# EAGLE design SAMD11_Breakout (EAGLE 6.6.0)
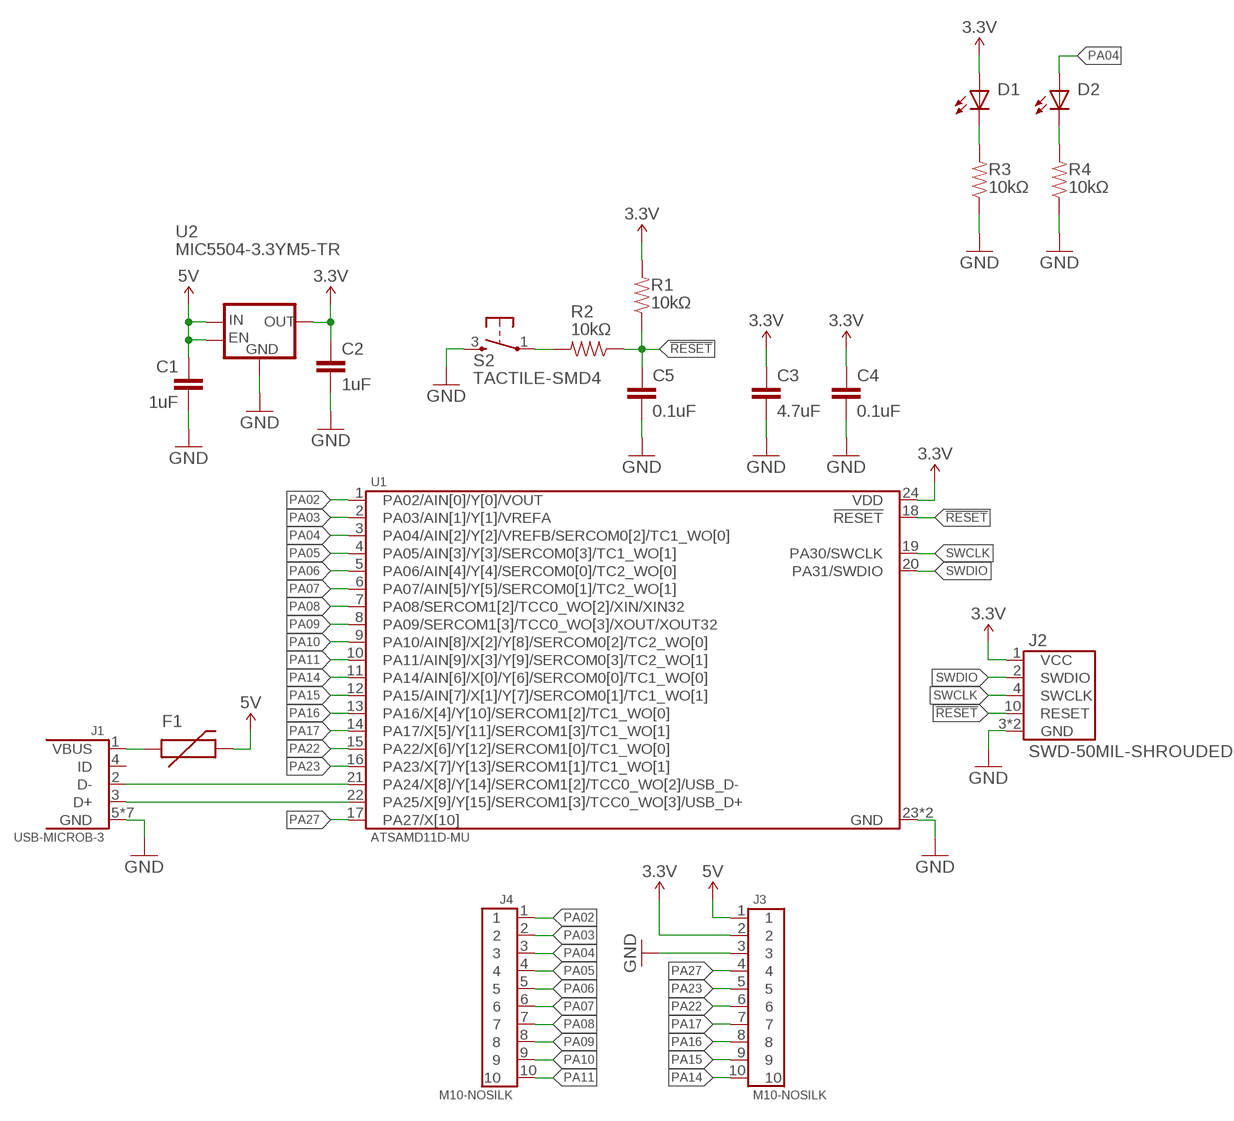
[diagram p0: schematic, sheet 1]

## Parts
C1  1uF  CAP-0603  [0603-CAP]
C2  1uF  CAP-0603  [0603-CAP]
C3  4.7uF  CAP-0603  [0603-CAP]
C4  0.1uF  CAP-0603  [0603-CAP]
C5  0.1uF  CAP-0603  [0603-CAP]
D1  LED-0603  [0603-LED]
D2  LED-0603  [0603-LED]
F1  PTC-1206  [1206-PTC]
J1  USB-MICROB-3  [10118192-0001LF]
J2  SWD-50MIL-SHROUDED2  [M05X2-50MIL-SHROUD]
J3  M10-NOSILK  [M10X1-NOSILK]
J4  M10-NOSILK  [M10X1-NOSILK]
R1  10kΩ  RESISTOR-0603  [0603-CAP]
R2  10kΩ  RESISTOR-0603  [0603-CAP]
R3  10kΩ  RESISTOR-0603  [0603-CAP]
R4  10kΩ  RESISTOR-0603  [0603-CAP]
S2  TACTILE-SMD4  [KMR741NG]
U1  ATSAMD11D-MU  [QFN-24]
U2  MIC5504-3.3YM5-TR  [SOT23-5]

## Nets
3.3V: C2.1 C3.1 C4.1 D1.A J2.1(VCC) J3.2 R1.2 U1.24(VDD) U2.5(OUT)
5V: C1.1 F1.P$2 J3.1 U2.1(IN) U2.3(EN)
!RESET: C5.1 J2.10(RESET) R1.1 R2.1 U1.18(!RESET)
D_N: J1.2(D-) U1.21(PA24/X[8]/Y[14]/SERCOM1[2]/TCC0_WO[2]/USB_D-)
D_P: J1.3(D+) U1.22(PA25/X[9]/Y[15]/SERCOM1[3]/TCC0_WO[3]/USB_D+)
GND: C1.2 C2.2 C3.2 C4.2 C5.2 J1.5(GND) J1.P$6(GND) J1.P$7(GND) J1.P$8(GND) J1.P$9(GND) J1.P$10(GND) J1.P$11(GND) J2.3(GND) J2.5(GND) J3.3 R3.1 R4.1 S2.3 U1.23(GND) U1.P$1(GND) U2.2(GND)
N$1: R2.2 S2.1
N$2: D2.C R4.2
N$3: D1.C R3.2
N$5: F1.P$1 J1.1(VBUS)
PA02: J4.1 U1.1(PA02/AIN[0]/Y[0]/VOUT)
PA03: J4.2 U1.2(PA03/AIN[1]/Y[1]/VREFA)
PA04: D2.A J4.3 U1.3(PA04/AIN[2]/Y[2]/VREFB/SERCOM0[2]/TC1_WO[0])
PA05: J4.4 U1.4(PA05/AIN[3]/Y[3]/SERCOM0[3]/TC1_WO[1])
PA06: J4.5 U1.5(PA06/AIN[4]/Y[4]/SERCOM0[0]/TC2_WO[0])
PA07: J4.6 U1.6(PA07/AIN[5]/Y[5]/SERCOM0[1]/TC2_WO[1])
PA08: J4.7 U1.7(PA08/SERCOM1[2]/TCC0_WO[2]/XIN/XIN32)
PA09: J4.8 U1.8(PA09/SERCOM1[3]/TCC0_WO[3]/XOUT/XOUT32)
PA10: J4.9 U1.9(PA10/AIN[8]/X[2]/Y[8]/SERCOM0[2]/TC2_WO[0])
PA11: J4.10 U1.10(PA11/AIN[9]/X[3]/Y[9]/SERCOM0[3]/TC2_WO[1])
PA14: J3.10 U1.11(PA14/AIN[6]/X[0]/Y[6]/SERCOM0[0]/TC1_WO[0])
PA15: J3.9 U1.12(PA15/AIN[7]/X[1]/Y[7]/SERCOM0[1]/TC1_WO[1])
PA16: J3.8 U1.13(PA16/X[4]/Y[10]/SERCOM1[2]/TC1_WO[0])
PA17: J3.7 U1.14(PA17/X[5]/Y[11]/SERCOM1[3]/TC1_WO[1])
PA22: J3.6 U1.15(PA22/X[6]/Y[12]/SERCOM1[0]/TC1_WO[0])
PA23: J3.5 U1.16(PA23/X[7]/Y[13]/SERCOM1[1]/TC1_WO[1])
PA27: J3.4 U1.17(PA27/X[10])
SWCLK: J2.4(SWCLK) U1.19(PA30/SWCLK)
SWDIO: J2.2(SWDIO) U1.20(PA31/SWDIO)
Unconnected: J1.4(ID)

## Library data of the parts
C1-C5 = Passives:CAP
D1 D2 = Passives:LED
F1 = Passives:PTC
J1 = Connectors:USB-MICROB
J2 = Connectors:SWD
J3 J4 = Connectors:M10
R1-R4 = Passives:RESISTOR
S2 = Passives:TACTILE
U1 = Atmel:ATSAMD11D
U2 = Microchip:MIC5504

## Board
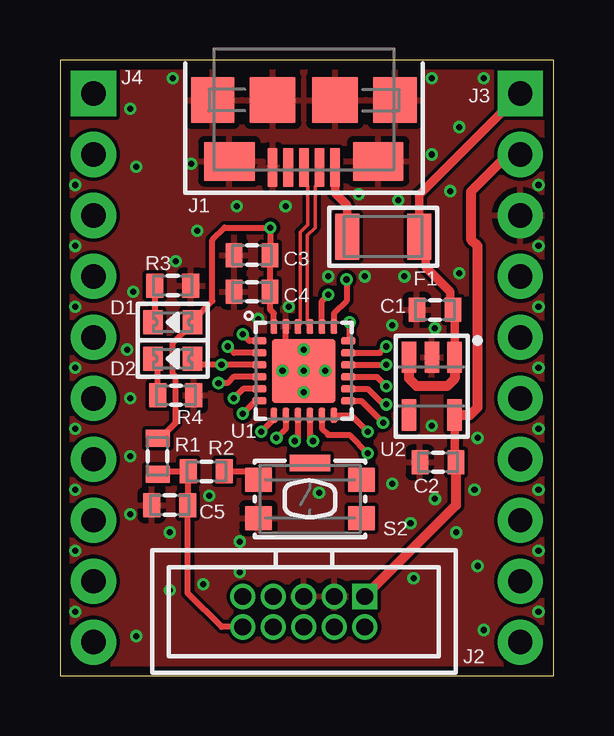
[diagram p1: board, top side]
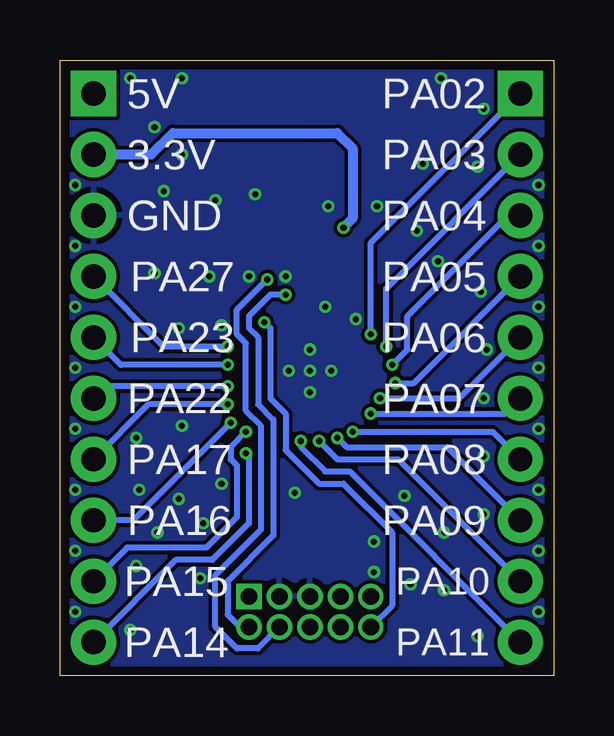
[diagram p2: board, bottom side, seen from below]

Size 20.57 x 25.65 mm. Coordinates in mm from the lower left corner, seen from the top.
Outline: 0,0 20.57,0 20.57,25.65 0,25.65 0,0
Copper layers (1*16): Top 0.035559375mm / dielectric 1.6mm / Bottom 0.035559375mm
Design rules "default *": minimum track width 6mil, minimum drill 10mil, track to track 6mil, track to pad 6mil, pad to pad 6mil, via to via 6mil, smd to smd 6mil, copper to edge 15mil, drill to drill 6mil, minimum pad ring 5mil, minimum via ring 5mil, stop-mask expansion 2.5mil, vias tented up to drill 20mil, thermal gap 10mil
tRestrict: 4 lines

### Footprints (pad centres in the part's own frame; a part is rotated, then mirrored left to right if it is on the bottom)
0603-CAP = smd 0.7 x 1: 1 -0.75,0; 2 0.75,0
0603-LED = smd 0.8 x 1: A 0.825,0; C -0.825,0
1206-PTC = smd 1 x 1.9: P$1 1.5,0; P$2 -1.5,0
10118192-0001LF = smd 1.6 x 0.4: 1 -0.1,1.3; 2 -0.1,0.65; 3 -0.1,0; 4 -0.1,-0.65; 5 -0.1,-1.3 | smd 1.6 x 2.1: P$6 -0.35,-3.1; P$7 -0.35,3.1 | smd 1.9 x 1.9: P$8 -2.9,1.3; P$9 -2.9,-1.3 | smd 1.9 x 1.8: P$10 -2.9,3.8; P$11 -2.9,-3.8
M05X2-50MIL-SHROUD = drill 0.7 pad 1 square: 1 -2.54,-0.635 | drill 0.7 pad 1: 2 -2.54,0.635; 3 -1.27,-0.635; 4 -1.27,0.635; 5 0,-0.635; 6 0,0.635; 7 1.27,-0.635; 8 1.27,0.635; 9 2.54,-0.635; 10 2.54,0.635
M10X1-NOSILK = drill 1.016 pad 1.88 square: 1 -11.43,0 | drill 1.016 pad 1.88: 2 -8.89,0; 3 -6.35,0; 4 -3.81,0; 5 -1.27,0; 6 1.27,0; 7 3.81,0; 8 6.35,0; 9 8.89,0; 10 11.43,0
KMR741NG = smd 1.1 x 1: 1 -2.15,0.8; 2 2.15,0.8; 3 -2.15,-0.8; 4 2.15,-0.8 | smd 1.7 x 0.7: GND 0,1.5
QFN-24 = smd 0.6 x 0.29: 1 -1.85,1.25; 2 -1.85,0.75; 3 -1.85,0.25; 4 -1.85,-0.25; 5 -1.85,-0.75; 6 -1.85,-1.25; 13 1.85,-1.25; 14 1.85,-0.75; 15 1.85,-0.25; 16 1.85,0.25; 17 1.85,0.75; 18 1.85,1.25 | smd 0.29 x 0.6: 7 -1.25,-1.85; 8 -0.75,-1.85; 9 -0.25,-1.85; 10 0.25,-1.85; 11 0.75,-1.85; 12 1.25,-1.85; 19 1.25,1.85; 20 0.75,1.85; 21 0.25,1.85; 22 -0.25,1.85; 23 -0.75,1.85; 24 -1.25,1.85 | smd 2.65 x 2.65: P$1 0,0
SOT23-5 = smd 1.3 x 0.6: 1 -1.2,0.95; 2 -1.2,0; 3 -1.2,-0.95; 4 1.2,-0.95; 5 1.2,0.95

### Placement (x,y rotation side)
C1  15.62,15.24 180 top
C2  15.75,8.89 180 top
C3  8,17.53 180 top
C4  8,16 180 top
C5  4.57,7.11 180 top
D1  4.7,14.73 0 top
D2  4.7,13.21 0 top
F1  13.46,18.29 180 top
J1  10.16,21.08 270 top
J2  10.16,2.67 180 top
J3  19.18,12.83 270 top
J4  1.4,12.83 270 top
R1  4.06,9.14 90 top
R2  6.1,8.51 0 top
R3  4.7,16.26 180 top
R4  4.83,11.68 180 top
S2  10.41,7.37 0 top
U1  10.16,12.7 0 top
U2  15.49,12.06 270 top

### Tracks (layer width: path | path; a pad name or v marks a point on that pad's centre or on a via)
3.3V  (via drill 0.25)
  Top 0.254: U1.24 8.91,15.09 8.75,15.25 C4.1 C3.1 8.76,17.54 v8.76,18.67 6.86,18.67 6.35,18.16 6.35,15.62 5.52,14.79 D1.A 5.52,14.67 4.7,13.84 4.7,12.57 4.83,12.45 4.83,10.54 4.18,9.89 R1.2
  Top 0.356: U2.5 16.44,8.94 C2.1
  Top 0.406: C2.1 16.5,7.1 J2.1 | U2.5 17.09,10.87 17.4,11.18 17.4,17.91 17.14,18.16 17.14,20.19 18.67,21.72 J3.2
  Bottom 0.406: J3.2 16.76,21.72 15.88,22.61 9.02,22.61 8.38,21.97 8.38,19.05 v8.76,18.67
5V
  Top 0.356: J3.1 14.96,20.04 F1.P$2 15.24,18.01 15.24,17.02 16.26,16 16.26,15.36 C1.1 16.44,15.17 U2.1
  Top 0.406: U2.1 16.44,12.38 16.13,12.06 14.86,12.06 14.54,12.38 U2.3
!RESET  (via drill 0.25)
  Top 0.254: R1.1 4.18,8.51 R2.1 5.32,8.48 C5.1 5.32,3.44 6.73,2.03 J2.10 | U1.18 12.06,14.01 v12.06,14.73
  Bottom 0.254: J2.10 6.73,2.92 6.73,5.97 8.76,8 9.78,8 11.18,9.4 11.18,10.92 11.81,11.56 11.81,14.48 v12.06,14.73
D_N
  Top 0.152: J1.2 10.81,20.56 10.63,20.38 10.63,18.67 10.31,18.35 10.31,14.65 U1.21
D_P
  Top 0.152: J1.3 10.16,20.55 10.32,20.38 10.32,18.8 10.01,18.48 10.01,14.65 U1.22
GND  (via drill 0.25)
  Top 0.254: U1.P$1 9.41,13.45 U1.23
  other vias: 10.16,12.7 9.27,12.7 11.05,12.7 10.16,13.59 10.16,11.81 2.92,9.14 0.64,10.29 0.64,12.83 0.64,15.37 0.64,17.91 0.64,20.45 2.92,23.62 16.64,22.86 19.94,20.45 19.94,17.91 19.94,15.37 19.94,12.83 19.94,10.29 19.94,7.75 19.94,5.21 19.94,2.67 0.64,7.75 0.64,5.21 0.64,2.67 3.17,1.65 16.26,20.19 8.26,14.86 3.17,21.21 7.37,19.56 9.4,19.56 11.18,16.64 14.35,16.64 16.64,16.76 15.49,21.72 2.92,6.73 4.57,5.97 6.22,7.49 7.49,5.59 4.57,3.56 14.73,4.06 16.51,5.97 14.61,6.35 15.62,7.37 17.27,7.75 17.4,4.57 17.65,1.91 10.79,7.62 13.84,8 15.49,10.41 17.4,9.91 15.62,14.48 13.84,14.61 5.71,18.54 4.83,17.27 3.05,16 2.79,13.59 2.92,11.56 7.49,4.32 5.97,3.81 14.1,19.81 5.46,21.34 4.7,24.89 9.53,15.37 12.7,16.64 12.45,20.07 15.49,24.89 17.65,24.89
  pour Bottom: -1.27,27.3 -1.27,-1.27 22.23,-1.27 22.23,27.3
  pour Top: -0.64,26.67 -0.64,-0.64 21.59,-0.64 21.59,26.67
N$1
  Top 0.254: R2.2 8.26,8.51 S2.1
N$2
  Top 0.254: R4.2 4.08,13.01 D2.C
N$3
  Top 0.254: R3.2 3.95,14.81 D1.C
N$5
  Top 0.356: J1.1 11.46,20.1 11.96,19.6 F1.P$1
PA02  (via drill 0.25)
  Top 0.254: U1.1 7.89,13.95 v7.62,14.22
  Bottom 0.254: v7.62,14.22 7.62,18.03 J4.1
PA03  (via drill 0.25)
  Top 0.254: U1.2 7.25,13.45 v6.99,13.72
  Bottom 0.254: v6.99,13.72 6.99,16.13 J4.2
PA04  (via drill 0.25)
  Top 0.254: U1.3 6.99,12.95 v6.73,12.95 5.78,12.95 D2.A
  Bottom 0.254: v6.73,12.95 6.1,13.59 6.1,14.99 1.91,19.18 J4.3
PA05  (via drill 0.25)
  Top 0.254: U1.4 7.24,12.45 6.99,12.19 v6.6,12.19
  Bottom 0.254: v6.6,12.19 5.84,12.19 J4.4
PA06  (via drill 0.25)
  Top 0.254: U1.5 7.63,11.95 v7.24,11.56
  Bottom 0.254: v7.24,11.56 3.94,11.56 J4.5
PA07  (via drill 0.25)
  Top 0.254: U1.6 8.15,11.45 v7.62,10.92
  Bottom 0.254: v7.62,10.92 2.03,10.92 J4.6
PA08  (via drill 0.25)
  Top 0.254: U1.7 8.91,10.69 v8.38,10.16
  Bottom 0.254: v8.38,10.16 2.54,10.16 J4.7
PA09  (via drill 0.25)
  Top 0.254: U1.8 9.41,10.3 v9.02,9.91
  Bottom 0.254: v9.02,9.91 8.64,9.53 4.45,9.53 J4.8
PA10  (via drill 0.25)
  Top 0.254: U1.9 9.91,9.91 v9.78,9.78
  Bottom 0.254: v9.78,9.78 9.02,9.02 6.48,9.02 J4.9
PA11  (via drill 0.25)
  Top 0.254: U1.10 10.41,9.91 v10.54,9.78
  Bottom 0.254: v10.54,9.78 10.54,9.53 9.53,8.51 8.51,8.51 J4.10
PA14  (via drill 0.25)
  Top 0.254: U1.11 10.91,10.3 11.18,10.03 12.06,10.03 v12.83,9.27
  Bottom 0.254: v12.83,9.27 12.7,9.14 12.7,6.35 14.22,4.83 15.75,4.83 J3.10
PA15  (via drill 0.25)
  Top 0.254: U1.12 12.14,10.85 v12.83,10.16
  Bottom 0.254: v12.83,10.16 13.46,9.53 13.46,9.02 13.21,8.76 13.21,6.6 14.48,5.33 17.78,5.33 J3.9
PA16  (via drill 0.25)
  Top 0.254: U1.13 12.55,11.45 v13.46,10.54
  Bottom 0.254: v13.46,10.54 17.53,6.48 J3.8
PA17  (via drill 0.25)
  Top 0.254: U1.14 12.81,11.95 13.46,11.3 v13.59,11.3
  Bottom 0.254: v13.59,11.3 16.89,11.3 J3.7
PA22  (via drill 0.25)
  Top 0.254: U1.15 13.2,12.45 v13.59,12.06
  Bottom 0.254: v13.59,12.06 18.67,12.06 J3.6
PA23  (via drill 0.25)
  Top 0.254: U1.16 v13.59,12.95
  Bottom 0.254: v13.59,12.95 18.03,12.95 J3.5
PA27  (via drill 0.25)
  Top 0.254: U1.17 13.32,13.45 v13.59,13.72
  Bottom 0.254: v13.59,13.72 16.26,13.72 J3.4
SWCLK  (via drill 0.25)
  Top 0.254: v11.94,16.51 11.94,15.62 11.41,15.09 U1.19
  Bottom 0.254: J2.4 12.32,1.14 13.21,1.14 14.1,2.03 14.1,4.19 12.19,6.1 12.19,10.41 12.83,11.05 12.83,13.84 13.21,14.22 13.21,15.24 v11.94,16.51
SWDIO  (via drill 0.25)
  Top 0.254: U1.20 10.91,15.61 v11.18,15.88
  Bottom 0.254: v11.18,15.88 11.81,15.88 12.7,14.99 12.7,14.48 12.32,14.1 12.32,11.3 11.68,10.67 11.68,5.84 13.59,3.94 13.59,2.54 13.08,2.03 J2.2

### Text on the board
bPlace: PA02 | 5V | PA03 | 3.3V | PA04 | GND | PA05 | PA27 | PA06 | PA23 | PA07 | PA22 | PA08 | PA17 | PA09 | PA16 | PA10 | PA15 | PA11 | PA14